# Altium schematic sheet CRSC0003.SchDoc: Critical System Computer - Memory
size A3; Engineer: Sam Shan Jiang; DocumentNumber: CRSC0003; SheetNumber: 3; SheetTotal: 5; : Record=PageOptions|CenterHorizontal=True|CenterVertical=True|PrintScale=1.00|XCorrection=1.00|YCorrection=1.00|PrintKind=1|BorderSize=5000000|LeftOffset=0|BottomOffset=0|Orientation=2|PaperLength=1000|PaperWidth=1000|Scale=100|PaperSource=7|PrintQuality=-4|MediaType=1|DitherType=10|PaperKind=A3|Pr; Description: Memory banks for the critical system computer; Version: 1.0
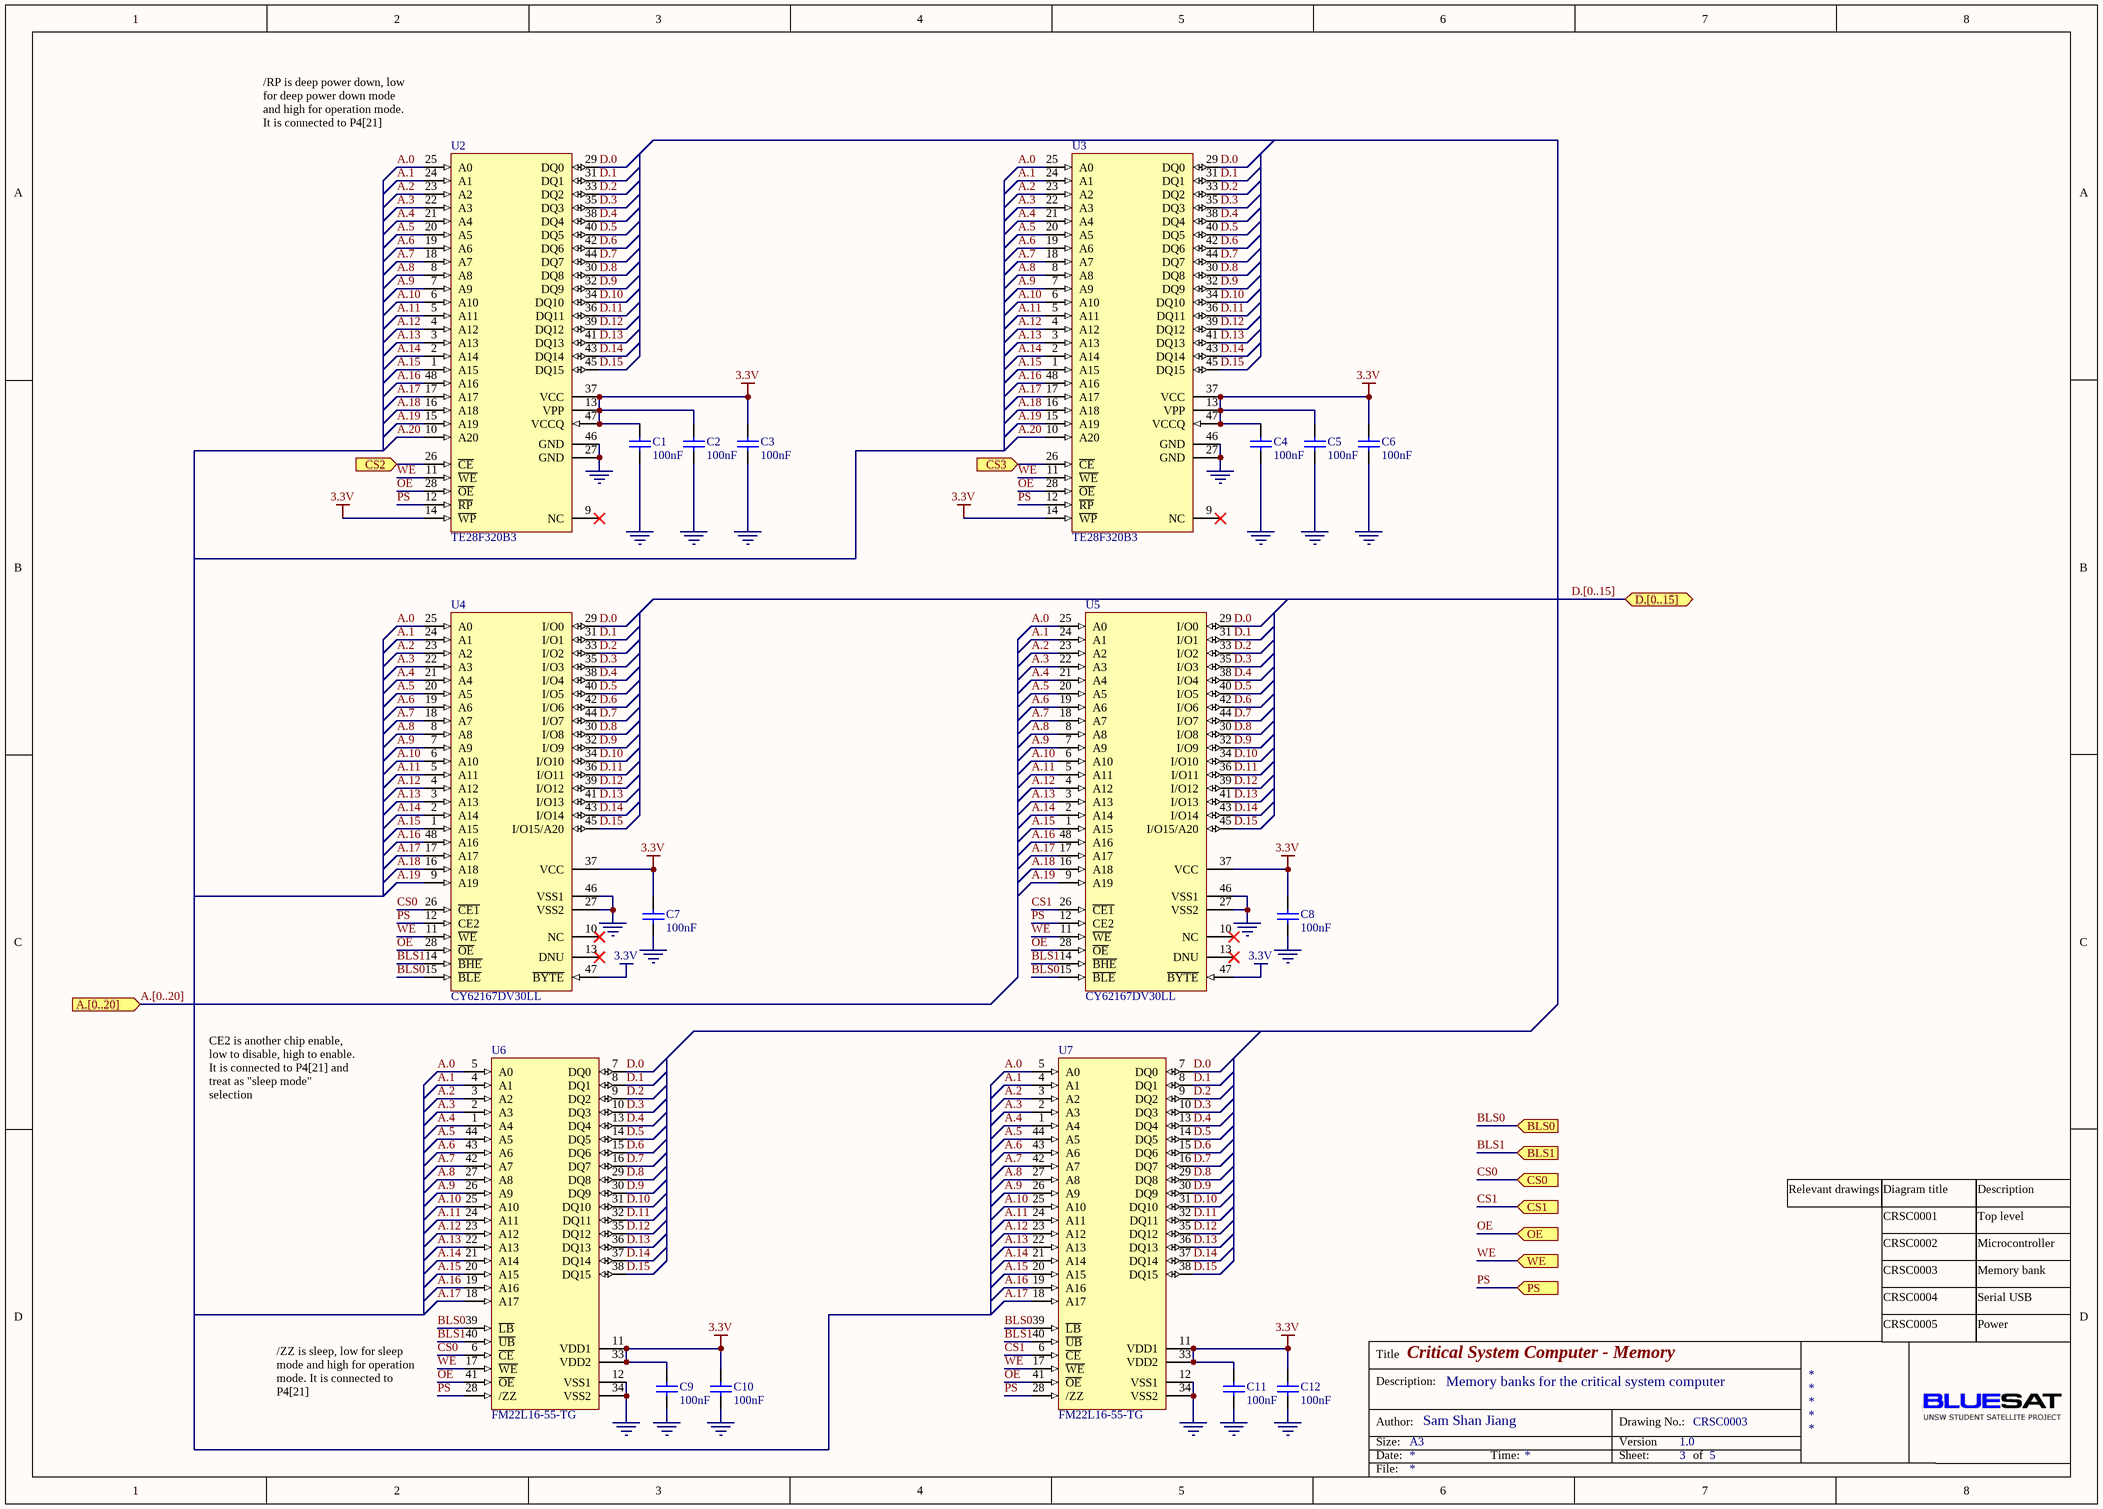
[diagram p0: CRSC0003.SchDoc]

## Parts
C1  100nF  [0805]
C2  100nF  [0805]
C3  100nF  [0805]
C4  100nF  [0805]
C5  100nF  [0805]
C6  100nF  [0805]
C7  100nF  [0805]
C8  100nF  [0805]
C9  100nF  [0805]
C10  100nF  [0805]
C11  100nF  [0805]
C12  100nF  [0805]
U2  TE28F320B3  [TSOP48_L]
U3  TE28F320B3  [TSOP48_L]
U4  CY62167DV30LL  [TSOP48_L]
U5  CY62167DV30LL  [TSOP48_L]
U6  FM22L16-55-TG  [TSOP2-44_M]
U7  FM22L16-55-TG  [TSOP2-44_M]

## Ports
A.[0..20] (in), BLS0 (in), BLS1 (in), CS0 (in), CS1 (in), CS2 (in), CS3 (in), D.[0..15] (bidir), OE (in), PS (in), WE (in)

## Nets
3.3V: C1.2 C2.2 C3.2 C4.2 C5.2 C6.2 C7.2 C8.2 C9.2 C10.2 C11.2 C12.2 U2.13(VPP) U2.14(~{WP}) U2.37(VCC) U2.47(VCCQ) U3.13(VPP) U3.14(~{WP}) U3.37(VCC) U3.47(VCCQ) U4.37(VCC) U4.47(~{BYTE}) U5.37(VCC) U5.47(~{BYTE}) U6.11(VDD1) U6.33(VDD2) U7.11(VDD1) U7.33(VDD2)
GND: C1.1 C2.1 C3.1 C4.1 C5.1 C6.1 C7.1 C8.1 C9.1 C10.1 C11.1 C12.1 U2.27(GND) U2.46(GND) U3.27(GND) U3.46(GND) U4.27(VSS2) U4.46(VSS1) U5.27(VSS2) U5.46(VSS1) U6.12(VSS1) U6.34(VSS2) U7.12(VSS1) U7.34(VSS2)
A.0: U2.25(A0) U3.25(A0) U4.25(A0) U5.25(A0) U6.5(A0) U7.5(A0)
A.1: U2.24(A1) U3.24(A1) U4.24(A1) U5.24(A1) U6.4(A1) U7.4(A1)
A.2: U2.23(A2) U3.23(A2) U4.23(A2) U5.23(A2) U6.3(A2) U7.3(A2)
A.3: U2.22(A3) U3.22(A3) U4.22(A3) U5.22(A3) U6.2(A3) U7.2(A3)
A.4: U2.21(A4) U3.21(A4) U4.21(A4) U5.21(A4) U6.1(A4) U7.1(A4)
A.5: U2.20(A5) U3.20(A5) U4.20(A5) U5.20(A5) U6.44(A5) U7.44(A5)
A.6: U2.19(A6) U3.19(A6) U4.19(A6) U5.19(A6) U6.43(A6) U7.43(A6)
A.7: U2.18(A7) U3.18(A7) U4.18(A7) U5.18(A7) U6.42(A7) U7.42(A7)
A.8: U2.8(A8) U3.8(A8) U4.8(A8) U5.8(A8) U6.27(A8) U7.27(A8)
A.9: U2.7(A9) U3.7(A9) U4.7(A9) U5.7(A9) U6.26(A9) U7.26(A9)
A.10: U2.6(A10) U3.6(A10) U4.6(A10) U5.6(A10) U6.25(A10) U7.25(A10)
A.11: U2.5(A11) U3.5(A11) U4.5(A11) U5.5(A11) U6.24(A11) U7.24(A11)
A.12: U2.4(A12) U3.4(A12) U4.4(A12) U5.4(A12) U6.23(A12) U7.23(A12)
A.13: U2.3(A13) U3.3(A13) U4.3(A13) U5.3(A13) U6.22(A13) U7.22(A13)
A.14: U2.2(A14) U3.2(A14) U4.2(A14) U5.2(A14) U6.21(A14) U7.21(A14)
A.15: U2.1(A15) U3.1(A15) U4.1(A15) U5.1(A15) U6.20(A15) U7.20(A15)
A.16: U2.48(A16) U3.48(A16) U4.48(A16) U5.48(A16) U6.19(A16) U7.19(A16)
A.17: U2.17(A17) U3.17(A17) U4.17(A17) U5.17(A17) U6.18(A17) U7.18(A17)
A.18: U2.16(A18) U3.16(A18) U4.16(A18) U5.16(A18)
A.19: U2.15(A19) U3.15(A19) U4.9(A19) U5.9(A19)
A.20: U2.10(A20) U3.10(A20)
BLS0: U4.15(~{BLE}) U5.15(~{BLE}) U6.39(~{LB}) U7.39(~{LB}) ; port BLS0
BLS1: U4.14(~{BHE}) U5.14(~{BHE}) U6.40(~{UB}) U7.40(~{UB}) ; port BLS1
CS0: U4.26(~{CE1}) U6.6(~{CE}) ; port CS0
CS1: U5.26(~{CE1}) U7.6(~{CE}) ; port CS1
CS2: U2.26(~{CE}) ; port CS2
CS3: U3.26(~{CE}) ; port CS3
D.0: U2.29(DQ0) U3.29(DQ0) U4.29(I/O0) U5.29(I/O0) U6.7(DQ0) U7.7(DQ0)
D.1: U2.31(DQ1) U3.31(DQ1) U4.31(I/O1) U5.31(I/O1) U6.8(DQ1) U7.8(DQ1)
D.2: U2.33(DQ2) U3.33(DQ2) U4.33(I/O2) U5.33(I/O2) U6.9(DQ2) U7.9(DQ2)
D.3: U2.35(DQ3) U3.35(DQ3) U4.35(I/O3) U5.35(I/O3) U6.10(DQ3) U7.10(DQ3)
D.4: U2.38(DQ4) U3.38(DQ4) U4.38(I/O4) U5.38(I/O4) U6.13(DQ4) U7.13(DQ4)
D.5: U2.40(DQ5) U3.40(DQ5) U4.40(I/O5) U5.40(I/O5) U6.14(DQ5) U7.14(DQ5)
D.6: U2.42(DQ6) U3.42(DQ6) U4.42(I/O6) U5.42(I/O6) U6.15(DQ6) U7.15(DQ6)
D.7: U2.44(DQ7) U3.44(DQ7) U4.44(I/O7) U5.44(I/O7) U6.16(DQ7) U7.16(DQ7)
D.8: U2.30(DQ8) U3.30(DQ8) U4.30(I/O8) U5.30(I/O8) U6.29(DQ8) U7.29(DQ8)
D.9: U2.32(DQ9) U3.32(DQ9) U4.32(I/O9) U5.32(I/O9) U6.30(DQ9) U7.30(DQ9)
D.10: U2.34(DQ10) U3.34(DQ10) U4.34(I/O10) U5.34(I/O10) U6.31(DQ10) U7.31(DQ10)
D.11: U2.36(DQ11) U3.36(DQ11) U4.36(I/O11) U5.36(I/O11) U6.32(DQ11) U7.32(DQ11)
D.12: U2.39(DQ12) U3.39(DQ12) U4.39(I/O12) U5.39(I/O12) U6.35(DQ12) U7.35(DQ12)
D.13: U2.41(DQ13) U3.41(DQ13) U4.41(I/O13) U5.41(I/O13) U6.36(DQ13) U7.36(DQ13)
D.14: U2.43(DQ14) U3.43(DQ14) U4.43(I/O14) U5.43(I/O14) U6.37(DQ14) U7.37(DQ14)
D.15: U2.45(DQ15) U3.45(DQ15) U4.45(I/O15/A20) U5.45(I/O15/A20) U6.38(DQ15) U7.38(DQ15)
OE: U2.28(~{OE}) U3.28(~{OE}) U4.28(~{OE}) U5.28(~{OE}) U6.41(~{OE}) U7.41(~{OE}) ; port OE
PS: U2.12(~{RP}) U3.12(~{RP}) U4.12(CE2) U5.12(CE2) U6.28(/ZZ) U7.28(/ZZ) ; port PS
WE: U2.11(~{WE}) U3.11(~{WE}) U4.11(~{WE}) U5.11(~{WE}) U6.17(~{WE}) U7.17(~{WE}) ; port WE

Not connected (* = marked no-connect by the designer): U2 9(NC)*; U3 9(NC)*; U4 10(NC)* 13(DNU)*; U5 10(NC)* 13(DNU)*

## Buses and harness runs
bus A.[0..20] = port A.[0..20]
bus D.[0..15] = port D.[0..15]

## Notes on the sheet
- (near U2) /RP is deep power down, low for deep power down mode and high for operation mode. It is connected to P4[21]
- CE2 is another chip enable, low to disable, high to enable. It is connected to P4[21] and treat as "sleep mode" selection
- Relevant drawings
- CRSC0001
- CRSC0002
- Diagram title
- Top level
- Microcontroller
- Description
- CRSC0003
- CRSC0004
- Memory bank
- Serial USB
- CRSC0005
- Power
- /ZZ is sleep, low for sleep mode and high for operation mode. It is connected to P4[21]
- Title
- Description:
- Size:
- Author:
- Date:
- A3
- Time:
- Version
- Sheet:
- Drawing No.:
- of
- File:

## Library data of the parts
C1-C12 = Cap: Capacitor; Manufacturer: Generic Components; Class: Passive; Published: 08/06/2000; Publisher: Altium Hobart Technology Centre; SubClass: Capacitor; Value: 100nF
U2 U3 = TE28F320B3: 32-Mbit (2M x 16) Advanced Boot Block Flash Memory; ColumnAddress: A0-A9; Publisher: Altium Limited; ComponentLink1Description: Manufacturer Link; ComponentLink2Description: Datasheet
U4 U5 = CY62167DV30LL: 16-Mbit (1M x 16) Static RAM; ColumnAddress: A0-A9; Publisher: Altium Limited; ComponentLink1Description: Manufacturer Link; ComponentLink2Description: Datasheet
U6 U7 = FM22L16-55-TG: FRAM, 2MB, 3V, 60NS, 44TSOP2; ColumnAddress: A0-A9; LatestRevisionDate: 13-Apr-2006; DatasheetVersion: rev1.1, Feb-2004; PackageReference: TSOP2-44_M; PackageDescription: 44-Pin Small Outline Package 0.8 mm Pitch; ComponentLink1Description: Manufacturer Link; ComponentLink2Description: Datasheet